# Altium schematic sheet TP_IHM_CONNECTOR.SchDoc
size A4
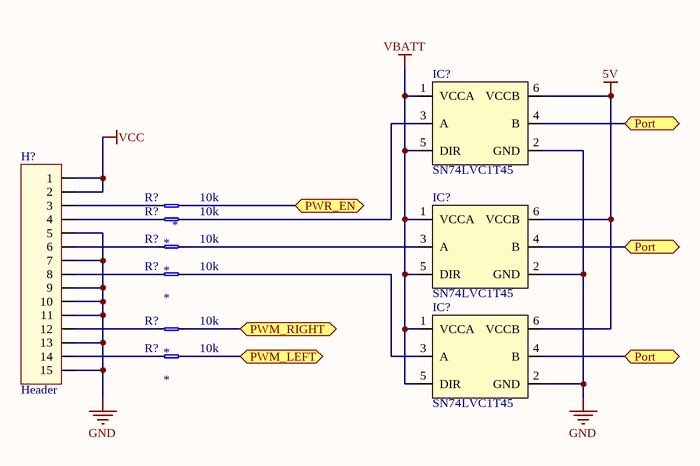
[diagram p0: TP_IHM_CONNECTOR.SchDoc]

## Parts
(Parts that share a designator on the sheet are numbered #1, #2 ... from top to bottom, then left to right.)
H?  Header  [653115131822]
IC?#1  SN74LVC1T45  [MO-203AB_LD]
IC?#2  SN74LVC1T45  [MO-203AB_LD]
IC?#3  SN74LVC1T45  [MO-203AB_LD]
R?#1  value 10k  [0603_RES_LD]  (hidden comment: Resistor)
R?#2  value 10k  [0603_RES_LD]  (hidden comment: Resistor)
R?#3  value 10k  [0603_RES_LD]  (hidden comment: Resistor)
R?#4  value 10k  [0603_RES_LD]  (hidden comment: Resistor)
R?#5  value 10k  [0603_RES_LD]  (hidden comment: Resistor)
R?#6  value 10k  [0603_RES_LD]  (hidden comment: Resistor)

## Ports
Port, PWM_LEFT, PWM_RIGHT, PWR_EN

## Nets
5V: IC?#1.6(VCCB) IC?#2.6(VCCB) IC?#3.6(VCCB)
GND: H?.5 H?.7 H?.9 H?.10 H?.11 H?.13 H?.15 IC?#1.2(GND) IC?#2.2(GND) IC?#3.2(GND)
VBATT: IC?#1.1(VCCA) IC?#1.5(DIR) IC?#2.1(VCCA) IC?#2.5(DIR) IC?#3.1(VCCA) IC?#3.5(DIR)
VCC: H?.1 H?.2
Port: IC?#1.4(B) IC?#2.4(B) IC?#3.4(B) ; port Port
PWM_LEFT: R?#6.2 ; port PWM_LEFT
PWM_RIGHT: R?#5.2 ; port PWM_RIGHT
PWR_EN: R?#1.2 ; port PWR_EN
NetH?_3: H?.3 R?#1.1
NetH?_4: H?.4 R?#2.1
NetH?_6: H?.6 R?#3.1
NetH?_8: H?.8 R?#4.1
NetH?_12: H?.12 R?#5.1
NetH?_14: H?.14 R?#6.1
NetIC?#1_3: IC?#1.3(A) R?#2.2
NetIC?#2_3: IC?#2.3(A) R?#3.2
NetIC?#3_3: IC?#3.3(A) R?#4.2

## Library data of the parts
H? = HEADER_15x1: Header 15x1
IC?#1-IC?#3 = SN74LVC1T45: Single Bit Dual Supply Buffer
R?#1-R?#6 = Resistor: Precision: *; Package: *